# EAGLE design STM8S903-breakout (EAGLE 9.4.2)
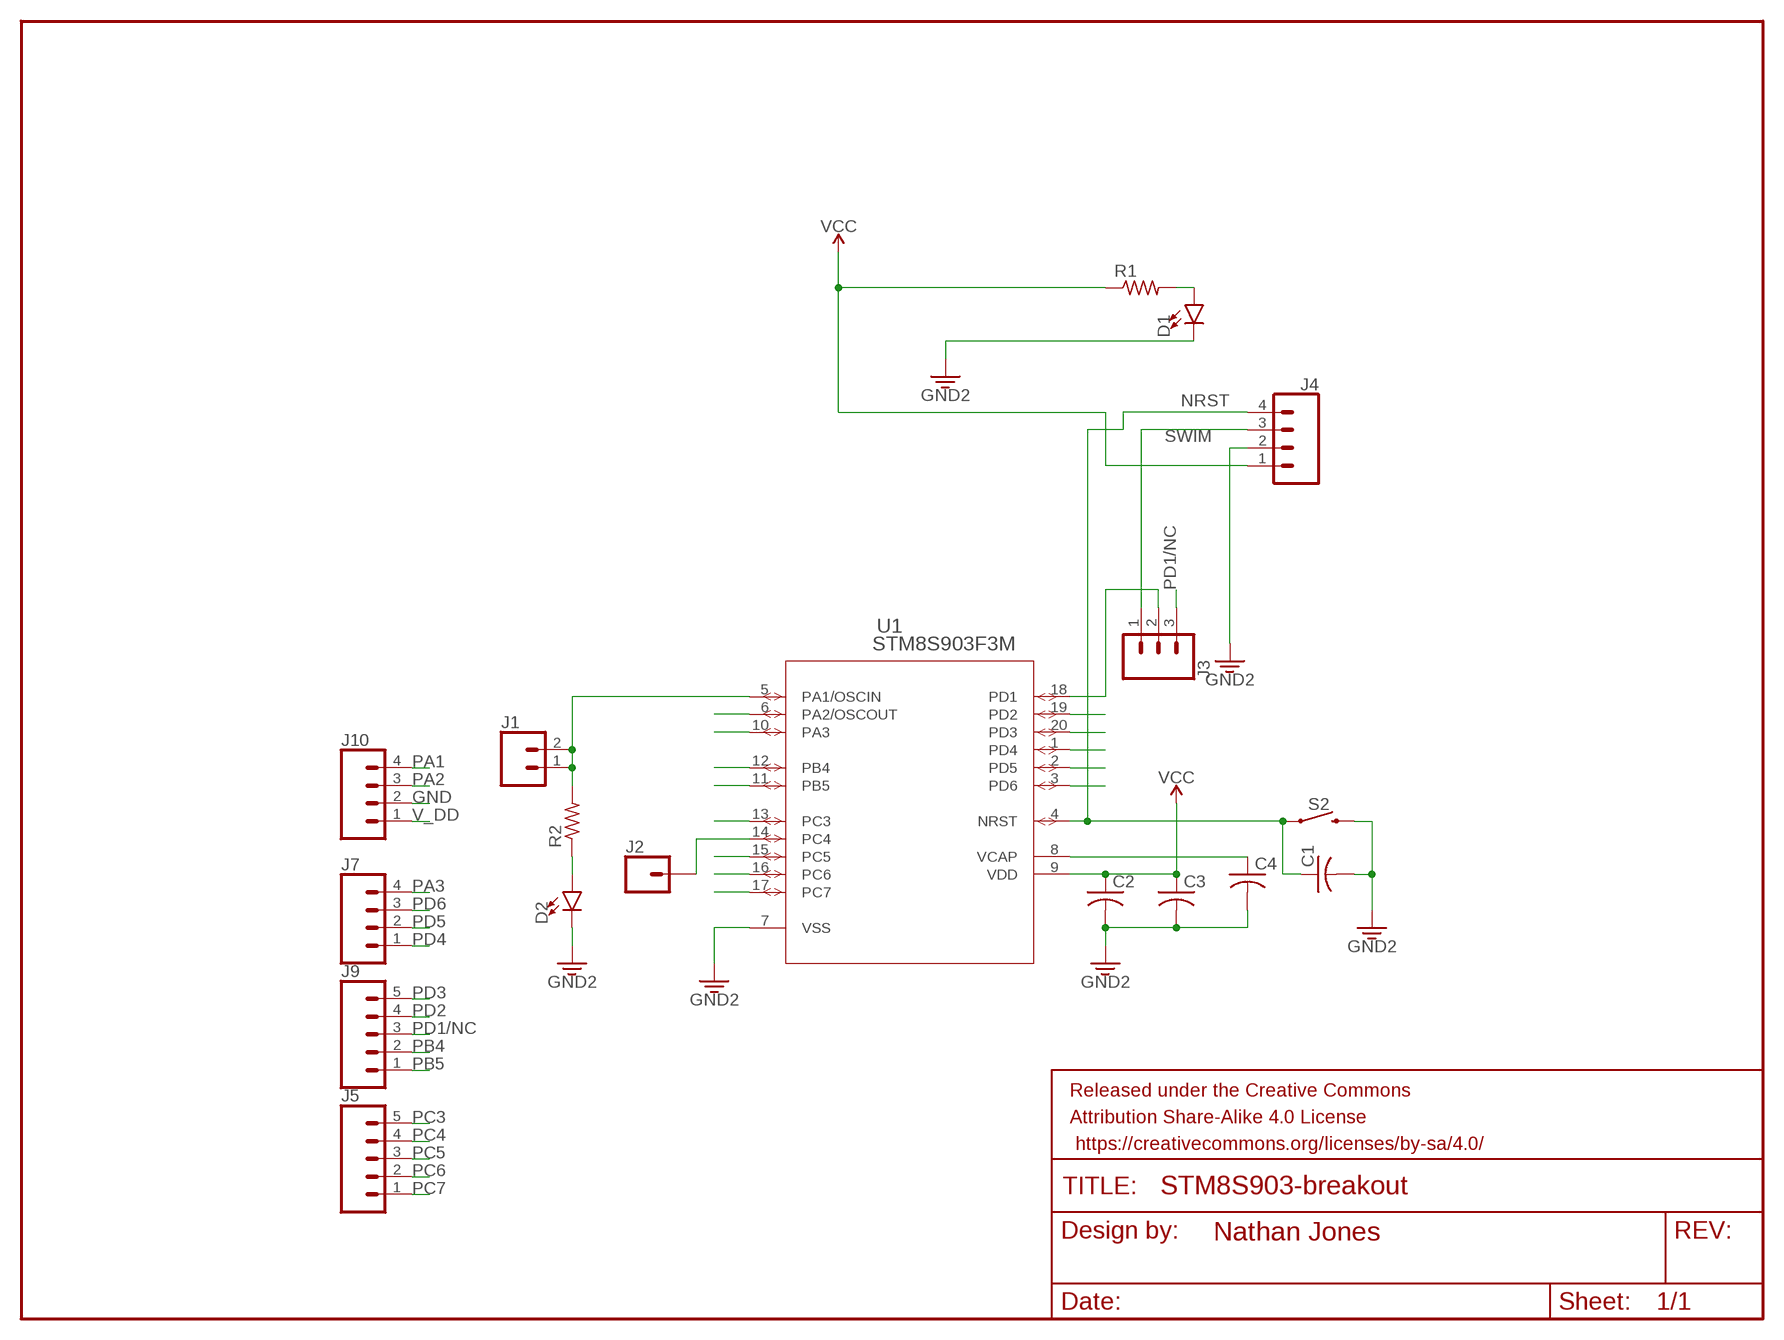
[diagram p0: schematic, sheet 1]

## Parts
C1  C-USC1206  [C1206]
C2  C-USC1206  [C1206]
C3  C-USC1206  [C1206]
C4  C-USC1206  [C1206]
D1  LED1206  [LED-1206]
D2  LED1206  [LED-1206]
FRAME1  FRAME-LETTERNO_PACKAGE  [DUMMY]
J1  CONN_02PTH3  [1X02_LONGPADS]
J2  CONN_01PTH_LONGPAD  [1X01_LONGPAD]
J3  CONN_03LONGPADS  [1X03_LONGPADS]
J4  CONN_04LONGPADS  [1X04_LONGPADS]
J5  CONN_05PTH_LONGPADS  [1X05_LONGPADS]
J7  CONN_04LONGPADS  [1X04_LONGPADS]
J9  CONN_05PTH_LONGPADS  [1X05_LONGPADS]
J10  CONN_04LONGPADS  [1X04_LONGPADS]
R1  R-US_R1206  [R1206]
R2  R-US_R1206  [R1206]
S2  MOMENTARY-SWITCH-SPST-SMD-4.5MM  [TACTILE_SWITCH_SMD_4.5MM]
U1  STM8S903F3M  [SO-20]

## Nets
GND [Power]: C1.2 C2.2 C3.2 C4.2 D1.C D2.C J4.2 J10.2 S2.1 S2.4 U1.7(VSS) ; supply symbol labelled GND2
N$3: D1.A R1.2
N$4: D2.A R2.1
NRST: C1.1 J4.4 S2.2 S2.3 U1.4(NRST)
PA1: J1.1 J1.2 J10.4 R2.2 U1.5(PA1/OSCIN)
PA2: J10.3 U1.6(PA2/OSCOUT)
PA3: J7.4 U1.10(PA3)
PB4: J9.2 U1.12(PB4)
PB5: J9.1 U1.11(PB5)
PC3: J5.5 U1.13(PC3)
PC4: J2.1 J5.4 U1.14(PC4)
PC5: J5.3 U1.15(PC5)
PC6: J5.2 U1.16(PC6)
PC7: J5.1 U1.17(PC7)
PD1: J3.2 U1.18(PD1)
PD1/NC: J3.3 J9.3
PD2: J9.4 U1.19(PD2)
PD3: J9.5 U1.20(PD3)
PD4: J7.1 U1.1(PD4)
PD5: J7.2 U1.2(PD5)
PD6: J7.3 U1.3(PD6)
SWIM: J3.1 J4.3
V_CAP: C4.1 U1.8(VCAP)
V_DD: C2.1 C3.1 J4.1 J10.1 R1.1 U1.9(VDD) ; supply symbol labelled VCC

## Library data of the parts
C1-C4 = adafruit:C-US: CAPACITOR, American symbol
D1 D2 = SparkFun-LED:LED: LED (Generic) Standard schematic elements and footprints for 5mm, 3mm, 1206, and 0603 sized LEDs. Generic LEDs with no color specified.
FRAME1 = SparkFun-Aesthetics:FRAME-LETTER: Schematic Frame - Letter Standard 8.5x11 US Letter frame; DESIGNER: Nathan Jones; VERSION: v01
J1 = SparkFun-Connectors:CONN_02: Multi connection point. Often used as Generic Header-pin footprint for 0.1 inch spaced/style header connections On any of the 0.1 inch spaced packages, you can populate with these: Break Away Headers - Straight <https://www.sparkfun.com/products/116> (PRT-00116) Break Away Male Headers - Right Angle <https://www.sparkfun.com/products/553> (PRT-00553) Female Headers <https://www.sparkfun.com/products/115> (PRT-00115) Break Away Headers - Machine Pin <https://www.sparkfun.com/products/117> (PRT-00117) Break Away Female Headers - Swiss Machine Pin <https://www.sparkfun.com/products/743> (PRT-00743) For SCREWTERMINALS and SPRING TERMINALS visit here: Screw Terimnals on SparkFun.com <https://www.sparkfun.com/search/results?term=Screw+Terminals> (5mm/3.5mm/2.54mm spacing) This device is also useful as a general connection point to wire up your design to another part of your project. Our various solder wires solder well into these plated through hole pads. Hook-Up Wire - Assortment (Stranded, 22 AWG) <https://www.sparkfun.com/products/11375> (PRT-11375) Hook-Up Wire - Assortment (Solid Core, 22 AWG) <https://www.sparkfun.com/products/11367> (PRT-11367) View the entire wire category on our website here <https://www.sparkfun.com/categories/141> Special notes: Molex polarized connector foot print use with: PRT-08233 with associated crimp pins and housings. 2.54_SCREWTERM for use with PRT-10571. 3.5mm Screw Terminal footprints for PRT-08084 5mm Screw Terminal footprints for use with PRT-08432
J2 = SparkFun-Connectors:CONN_01: Single connection point. Often used as Generic Header-pin footprint for 0.1 inch spaced/style header connections On any of the 0.1 inch spaced packages, you can populate with these: Break Away Headers - Straight <https://www.sparkfun.com/products/116> (PRT-00116) Break Away Male Headers - Right Angle <https://www.sparkfun.com/products/553> (PRT-00553) Female Headers <https://www.sparkfun.com/products/115> (PRT-00115) Break Away Headers - Machine Pin <https://www.sparkfun.com/products/117> (PRT-00117) Break Away Female Headers - Swiss Machine Pin <https://www.sparkfun.com/products/743> (PRT-00743) This device is also useful as a general connection point to wire up your design to another part of your project. Our various solder wires solder well into these plated through hole pads. Hook-Up Wire - Assortment (Stranded, 22 AWG) <https://www.sparkfun.com/products/11375> (PRT-11375) Hook-Up Wire - Assortment (Solid Core, 22 AWG) <https://www.sparkfun.com/products/11367> (PRT-11367) View the entire wire category on our website here <https://www.sparkfun.com/categories/141> Special notes: SMTSO-256-ET is a "flush mount" nut for a 4-40 screw. We mostly use this on specialty testbeds; it is a nice way to connect hardware to your PCB at an adjustable hieght. Also note, the SNAP packages are for using a snappable style connector. We sell a baggie of snaps and they are also used on two LilyPad designs: Snap Assortment - 30 pack (male and female) <https://www.sparkfun.com/products/11347> (DEV-11347) LilyPad Arduino SimpleSnap <https://www.sparkfun.com/products/10941> (DEV-10941) LilyPad SimpleSnap Protoboard <https://www.sparkfun.com/products/10940> (DEV-10940)
J3 = SparkFun-Connectors:CONN_03: Multi connection point. Often used as Generic Header-pin footprint for 0.1 inch spaced/style header connections On any of the 0.1 inch spaced packages, you can populate with these: Break Away Headers - Straight <https://www.sparkfun.com/products/116> (PRT-00116) Break Away Male Headers - Right Angle <https://www.sparkfun.com/products/553> (PRT-00553) Female Headers <https://www.sparkfun.com/products/115> (PRT-00115) Break Away Headers - Machine Pin <https://www.sparkfun.com/products/117> (PRT-00117) Break Away Female Headers - Swiss Machine Pin <https://www.sparkfun.com/products/743> (PRT-00743) Stackable Header - 3 Pin (Female, 0.1") <https://www.sparkfun.com/products/13875> (PRT-13875) For SCREWTERMINALS and SPRING TERMINALS visit here: Screw Terimnals on SparkFun.com <https://www.sparkfun.com/search/results?term=Screw+Terminals> (5mm/3.5mm/2.54mm spacing) This device is also useful as a general connection point to wire up your design to another part of your project. Our various solder wires solder well into these plated through hole pads. Hook-Up Wire - Assortment (Stranded, 22 AWG) <https://www.sparkfun.com/products/11375> (PRT-11375) Hook-Up Wire - Assortment (Solid Core, 22 AWG) <https://www.sparkfun.com/products/11367> (PRT-11367) View the entire wire category on our website here <https://www.sparkfun.com/categories/141> Special notes: Molex polarized connector foot print use with SKU : PRT-08232 with associated crimp pins and housings.
J4 J7 J10 = SparkFun-Connectors:CONN_04: Multi connection point. Often used as Generic Header-pin footprint for 0.1 inch spaced/style header connections On any of the 0.1 inch spaced packages, you can populate with these: Break Away Headers - Straight <https://www.sparkfun.com/products/116> (PRT-00116) Break Away Male Headers - Right Angle <https://www.sparkfun.com/products/553> (PRT-00553) Female Headers <https://www.sparkfun.com/products/115> (PRT-00115) Break Away Headers - Machine Pin <https://www.sparkfun.com/products/117> (PRT-00117) Break Away Female Headers - Swiss Machine Pin <https://www.sparkfun.com/products/743> (PRT-00743) For SCREWTERMINALS and SPRING TERMINALS visit here: Screw Terimnals on SparkFun.com <https://www.sparkfun.com/search/results?term=Screw+Terminals> (5mm/3.5mm/2.54mm spacing) This device is also useful as a general connection point to wire up your design to another part of your project. Our various solder wires solder well into these plated through hole pads. Hook-Up Wire - Assortment (Stranded, 22 AWG) <https://www.sparkfun.com/products/11375> (PRT-11375) Hook-Up Wire - Assortment (Solid Core, 22 AWG) <https://www.sparkfun.com/products/11367> (PRT-11367) View the entire wire category on our website here <https://www.sparkfun.com/categories/141> Special notes: Molex polarized connector foot print use with SKU : PRT-08231 with associated crimp pins and housings. 1MM SMD Version SKU: PRT-10208; PROD_ID: CONN-09696
J5 J9 = SparkFun-Connectors:CONN_05: Multi connection point. Often used as Generic Header-pin footprint for 0.1 inch spaced/style header connections On any of the 0.1 inch spaced packages, you can populate with these: Break Away Headers - Straight <https://www.sparkfun.com/products/116> (PRT-00116) Break Away Male Headers - Right Angle <https://www.sparkfun.com/products/553> (PRT-00553) Female Headers <https://www.sparkfun.com/products/115> (PRT-00115) Break Away Headers - Machine Pin <https://www.sparkfun.com/products/117> (PRT-00117) Break Away Female Headers - Swiss Machine Pin <https://www.sparkfun.com/products/743> (PRT-00743) For SCREWTERMINALS and SPRING TERMINALS visit here: Screw Terimnals on SparkFun.com <https://www.sparkfun.com/search/results?term=Screw+Terminals> (5mm/3.5mm/2.54mm spacing) This device is also useful as a general connection point to wire up your design to another part of your project. Our various solder wires solder well into these plated through hole pads. Hook-Up Wire - Assortment (Stranded, 22 AWG) <https://www.sparkfun.com/products/11375> (PRT-11375) Hook-Up Wire - Assortment (Solid Core, 22 AWG) <https://www.sparkfun.com/products/11367> (PRT-11367) View the entire wire category on our website here <https://www.sparkfun.com/categories/141> Special notes: Molex polarized connector foot print use with SKU : PRT-08231 with associated crimp pins and housings. 1MM SMD Version SKU: PRT-10208
R1 R2 = adafruit:R-US_: RESISTOR, American symbol
S2 = SparkFun-Switches:MOMENTARY-SWITCH-SPST: Momentary Switch (Pushbutton) - SPST Normally-open (NO) SPST momentary switches (buttons, pushbuttons). Variants PTH-12MM - 12mm square, through-hole Momentary Pushbutton Switch - 12mm Square <https://www.sparkfun.com/products/9190> (COM-09190) PTH-6.0MM, PTH-6.0MM-KIT - 6.0mm square, through-hole Mini Pushbutton Switch <https://www.sparkfun.com/products/97> (COM-00097) KIT package intended for soldering kit's - only one side of pads' copper is exposed. PTH-RIGHT-ANGLE-KIT - Right-angle, through-hole Right Angle Tactile Button <https://www.sparkfun.com/products/10791> - Used on SparkFun BigTime Watch Kit <https://www.sparkfun.com/products/11734> SMD-12MM - 12mm square, surface-mount Tactile Button - SMD (12mm) <https://www.sparkfun.com/products/12993> (COM-12993) Used on SparkFun PicoBoard <https://www.sparkfun.com/products/11888> SMD-4.5MM - 4.5mm Square Trackball Switch Used on SparkFun Blackberry Trackballer Breakout <https://www.sparkfun.com/products/13169> SMD-4.6MMX2.8MM - 4.60mm x 2.80mm, surface mount Used on SparkFun SAMD21 Mini Breakout <https://www.sparkfun.com/products/13664> SMD-5.2MM, SMD-5.2-REDUNDANT - 5.2mm square, surface-mount Mini Pushbutton Switch - SMD <https://www.sparkfun.com/products/8720> (COM-08720) Used on Arduino Pro Mini <https://www.sparkfun.com/products/11114> REDUNDANT package connects both switch circuits together SMD-6.0X3.5MM - 6.0 x 3.5mm, surface mount Momentary Reset Switch SMD <https://www.sparkfun.com/products/8229> (COM-08229) SMD-6.2MM-TALL - 6.2mm square, surface mount Tactile Button - SMD (6mm) <https://www.sparkfun.com/products/12992> Used on SparkFun Digital Sandbox <https://www.sparkfun.com/products/12651> SMD-RIGHT-ANGLE - Right-angle, surface mount Used on SparkFun Block for Intel® Edison - Arduino <https://www.sparkfun.com/products/13036>; PROD_ID: SWCH-09213
U1 = STM8:STM8S903F3M; MANUFACTURER_PART_NUMBER: STM8S903F3M; VENDOR: STMicroelectronics

## Net classes
0 default: width 0.152 mm, drill 0.152 mm, clearance 0.152 mm
1 Power: width 0.406 mm, drill 0.152 mm, clearance 0.152 mm

## Board
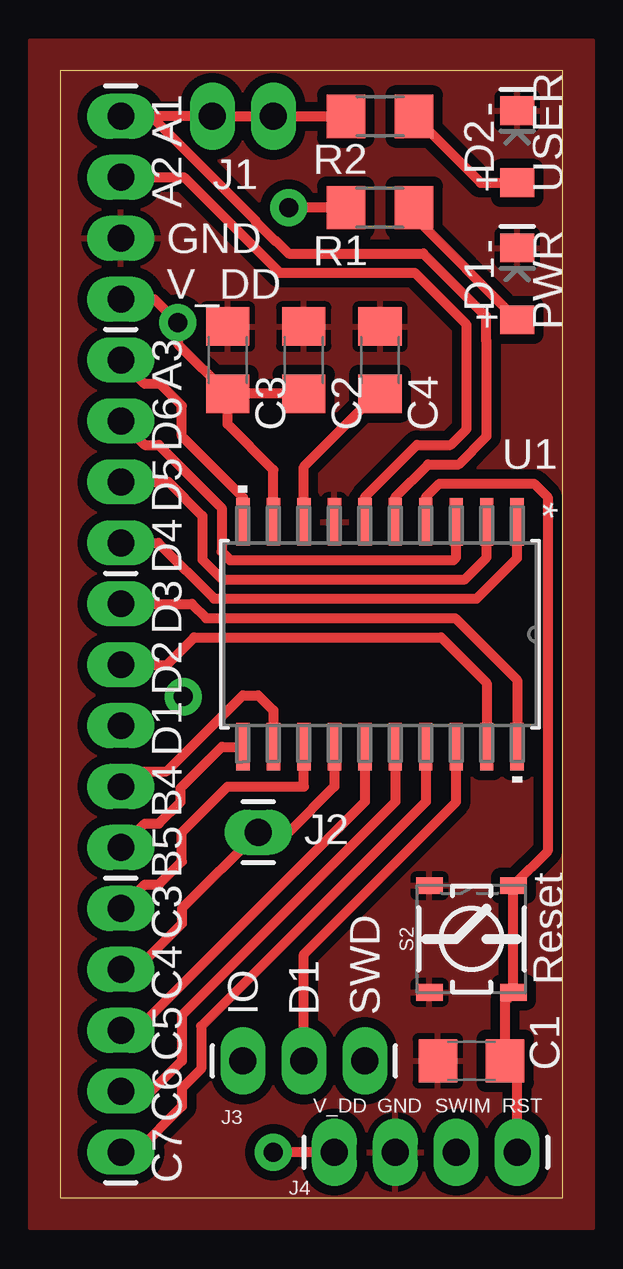
[diagram p1: board, top side]
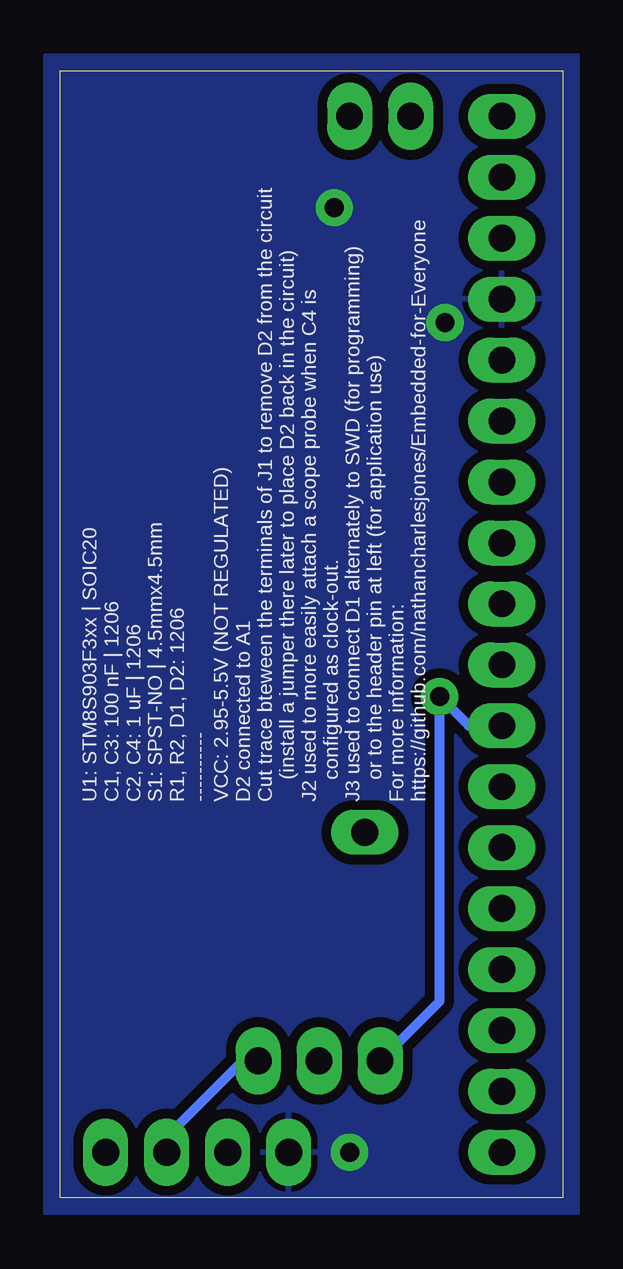
[diagram p2: board, bottom side, seen from below]

Size 20.95 x 46.99 mm. Coordinates in mm from the lower left corner, seen from the top.
Outline: 0,0 20.95,0 20.95,46.99 0,46.99 0,0
Copper layers (1*16): Top 0.035mm / dielectric 1.5mm / Bottom 0.035mm
Design rules "OthermillDRC_1_64_v2": minimum track width 16mil, minimum drill 31mil, track to track 0.39878125mm, track to pad 0.39878125mm, pad to pad 0.39878125mm, via to via 0.39878125mm, smd to smd 0mil, copper to edge 0mil, drill to drill 1mil, minimum pad ring 0mil, minimum via ring 15mil, stop-mask expansion 1mil, vias tented up to drill 30mil, thermal gap 10mil

### Footprints (pad centres in the part's own frame; a part is rotated, then mirrored left to right if it is on the bottom)
C1206 = smd 1.6 x 1.8: 1 -1.4,0; 2 1.4,0
LED-1206 = smd 1.2 x 1.4: A -1.5,0; C 1.5,0
1X02_LONGPADS = drill 1.118 pad 1.88 long: 1 0,0; 2 2.54,0
1X01_LONGPAD = drill 1.118 pad 1.88 long: 1 0,0
1X03_LONGPADS = drill 1.118 pad 1.88 long: 1 0,0; 2 2.54,0; 3 5.08,0
1X04_LONGPADS = drill 1.118 pad 1.88 long: 1 0,0; 2 2.54,0; 3 5.08,0; 4 7.62,0
1X05_LONGPADS = drill 1.118 pad 1.88 long: 1 0,0; 2 2.54,0; 3 5.08,0; 4 7.62,0; 5 10.16,0
R1206 = smd 1.6 x 1.803: 1 -1.422,0; 2 1.422,0
TACTILE_SWITCH_SMD_4.5MM = smd 0.7 x 1.1: 1 2.225,1.75; 2 2.225,-1.75; 3 -2.225,-1.75; 4 -2.225,1.75
SO-20 = smd 1.981 x 0.559: 1 -4.686,5.715; 2 -4.686,4.445; 3 -4.686,3.175; 4 -4.686,1.905; 5 -4.686,0.635; 6 -4.686,-0.635; 7 -4.686,-1.905; 8 -4.686,-3.175; 9 -4.686,-4.445; 10 -4.686,-5.715; 11 4.686,-5.715; 12 4.686,-4.445; 13 4.686,-3.175; 14 4.686,-1.905; 15 4.686,-0.635; 16 4.686,0.635; 17 4.686,1.905; 18 4.686,3.175; 19 4.686,4.445; 20 4.686,5.715

### Placement (x,y rotation side)
C1  17.14,5.71 180 top
C2  10.16,34.92 90 top
C3  6.99,34.92 90 top
C4  13.34,34.92 90 top
D1  19.05,38.1 90 top
D2  19.05,43.81 90 top
FRAME1  0.64,0.64 0 top
J1  8.89,45.09 180 top
J2  8.26,15.24 270 top
J3  12.7,5.71 180 top
J4  11.43,1.91 0 top
J5  2.54,1.91 90 top
J7  2.54,27.3 90 top
J9  2.54,14.61 90 top
J10  2.54,37.47 90 top
R1  13.34,41.27 0 top
R2  13.34,45.09 180 top
S2  17.14,10.79 90 top
U1  13.34,23.5 270 top

### Tracks (layer width: path | path; a pad name or v marks a point on that pad's centre or on a via)
GND
  pour Top: -1.27,-1.27 22.23,-1.27 22.23,48.26 -1.27,48.26
N$3
  Top 0.406: D1.A 14.76,40.89 R1.2
N$4
  Top 0.406: R2.1 17.53,42.31 D2.A
NRST
  Top 0.406: J4.4 19.05,5.21 C1.1 18.55,8.22 S2.3 S2.2 20.32,14.45 20.32,29.21 19.76,29.77 15.8,29.77 15.24,29.21 U1.4
PA1
  Top 0.406: R2.2 J1.1 J1.2 J10.4 3.81,45.09 8.15,40.75 8.15,40.7 8.96,39.9 9,39.9 9.53,39.37 15.14,39.37 17.75,36.76 17.75,35.75 17.78,35.72 17.78,31.75 16.61,30.58 15.34,30.58 13.97,29.21 U1.5
PA2
  Top 0.406: J10.3 5.17,42.55 9.15,38.56 14.78,38.56 16.94,36.4 16.94,32.05 16.28,31.38 14.87,31.38 12.7,29.21 U1.6
PA3
  Top 0.406: J7.4 3.54,33.93 4.17,33.93 5.08,33.02 5.08,31.75 7.62,29.21 U1.10
PB4
  Top 0.406: J9.2 3.17,17.78 4.45,17.78 7.62,20.95 8.26,20.95 8.89,20.32 U1.12
PB5
  Top 0.406: U1.11 6.74,18.81 5.02,17.09 5.02,16.51 4.12,15.6 3.54,15.6 J9.1
PC3
  Top 0.406: J5.5 3.54,13.06 4.12,13.06 5.08,14.03 5.08,15.24 6.99,17.14 10.16,17.14 U1.13
PC4
  Top 0.406: U1.14 11.43,17.14 9.53,15.24 J2.1 5.08,12.06 5.08,11.43 3.17,9.53 J5.4
PC5
  Top 0.406: J5.3 3.17,6.99 12.7,16.51 U1.15
PC6
  Top 0.406: U1.16 13.97,16.51 5.08,7.62 5.08,5.71 3.81,4.45 J5.2
PC7
  Top 0.406: J5.1 3.17,1.91 5.08,3.81 5.08,4.58 5.88,5.38 5.88,7.16 15.24,16.51 U1.17
PD1
  Top 0.406: J3.2 10.16,10.16 16.51,16.51 U1.18
PD1/NC  (via drill 0.79)
  Bottom 0.406: J9.3 3.93,19.68 v5.14,20.9 5.14,8.2 J3.3
PD2
  Top 0.406: J9.4 4.45,22.23 5.59,23.37 15.88,23.37 17.78,21.46 U1.19
PD3
  Top 0.406: J9.5 5.5,24.77 6.09,24.17 16.47,24.17 19.05,21.59 U1.20
PD4
  Top 0.406: J7.1 4.1,27.3 6.42,24.98 17.36,24.98 19.05,26.67 U1.1
PD5
  Top 0.406: J7.2 4.52,29.84 5.93,28.43 5.93,26.61 6.76,25.78 16.87,25.78 17.78,26.7 U1.2
PD6
  Top 0.406: J7.3 3.54,31.39 4.12,31.39 6.74,28.77 6.74,26.94 7.09,26.59 16.4,26.59 16.51,26.7 U1.3
SWIM
  Bottom 0.406: J3.1 13.34,5.71 16.51,2.54 J4.3
V_CAP
  Top 0.406: U1.8 10.16,30.48 13.21,33.52 C4.1
V_DD  (via drill 0.79)
  Top 0.406: J10.1 3.93,37.47 v4.91,36.48 4.91,35.6 C3.1 | C3.1 6.99,32.25 8.89,30.35 U1.9 | C2.1 C3.1 | J4.1 v8.89,1.91 | R1.1 v9.53,41.27
  pour Bottom: -0.64,-0.64 21.59,-0.64 21.59,47.62 -0.64,47.62

### Text on the board
tNames: - | A1 | + | USER | A2 | GND | - | V_DD | + | PWR | A3 | D6 | D5 | D4 | D3 | D2 | D1 | B4 | B5 | C3 | Reset | C4 | IO | D1 | SWD | C5 | V_DD | GND | SWIM | RST | C6 | C7
bNames: U1: STM8S903F3xx | SOIC20 / C1, C3: 100 nF | 1206 / C2, C4: 1 uF | 1206 / S1: SPST-NO | 4.5mmx4.5mm / R1, R2, D1, D2: 1206 / ---------- / VCC: 2.95-5.5V (NOT REGULATED) / D2 connected to A1 / Cut trace bteween the terminals of J1 to remove D2 from the circuit / (install a jumper there later to place D2 back in the circuit) / J2 used to more easily attach a scope probe when C4 is / configured as clock-out. / J3 used to connect D1 alternately to SWD (for programming) / or to the header pin at left (for application use) / For more information: / https://github.com/nathancharlesjones/Embedded-for-Everyone